# EAGLE design improved-handheld-turbidimeter_DAC_LED (EAGLE 7.3.0)
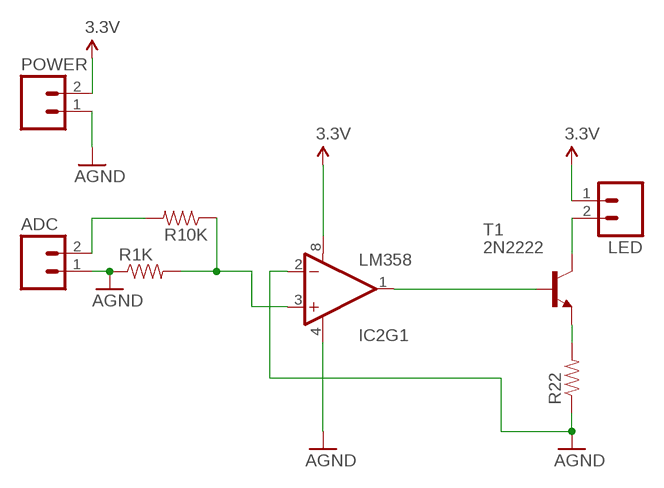
[diagram p0: schematic, sheet 1]

## Parts
ADC  M02PTH  [1X02]
IC2  LM358  [DIP08]
LED  M02PTH  [1X02]
POWER  M02PTH  [1X02]
R1K  RESISTOR0603-RES  [0603-RES]
R10K  RESISTOR0603-RES  [0603-RES]
R22  RESISTOR0603-RES  [0603-RES]
T1  2N2222  [TO92-EBC-OVAL]

## Nets
3.3V: IC2.8(V+) LED.1 POWER.2
AGND: ADC.1 IC2.2(-IN) IC2.4(V-) POWER.1 R1K.1 R22.1
N$1: IC2.1(OUT) T1.B
N$2: LED.2 T1.C
N$3: R22.2 T1.E
N$5: ADC.2 R10K.2
N$6: IC2.3(+IN) R1K.2 R10K.1
Unconnected: IC2.5(+IN) IC2.6(-IN) IC2.7(OUT)

## Library data of the parts
ADC LED POWER = SparkFun-Connectors:M02: Standard 2-pin 0.1" header. Use with - straight break away headers ( PRT-00116) - right angle break away headers (PRT-00553) - swiss pins (PRT-00743) - machine pins (PRT-00117) - female headers (PRT-00115) Molex polarized connector foot print use with: PRT-08233 with associated crimp pins and housings. 2.54_SCREWTERM for use with PRT-10571. 3.5mm Screw Terminal footprints for PRT-08084 5mm Screw Terminal footprints for use with PRT-08432
IC2 = SparkFun-AnalogIC:LM358: Jellybean op-amp; PROD_ID: IC-09172
R1K R10K R22 = SparkFun-Passives:RESISTOR: Resistor Basic schematic elements and footprints for 0603, 1206, and PTH resistors.
T1 = adafruit:2N2222: NPN TRANSISTOR Big oval pads

## Board
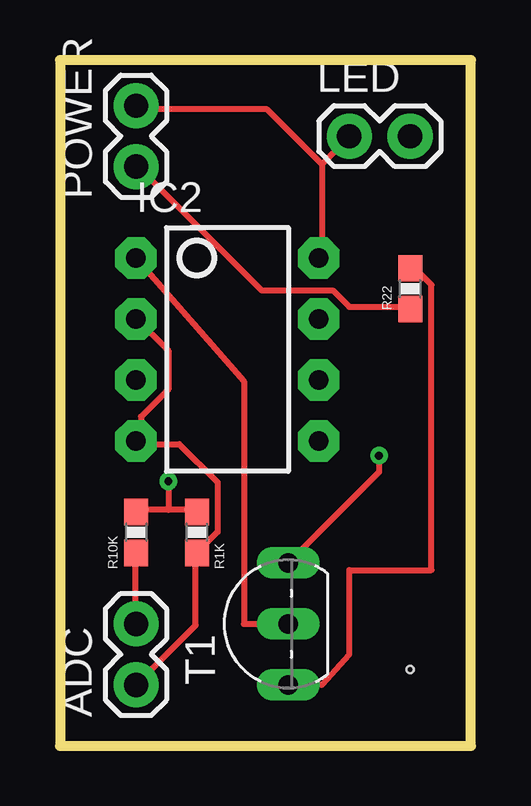
[diagram p1: board, top side]
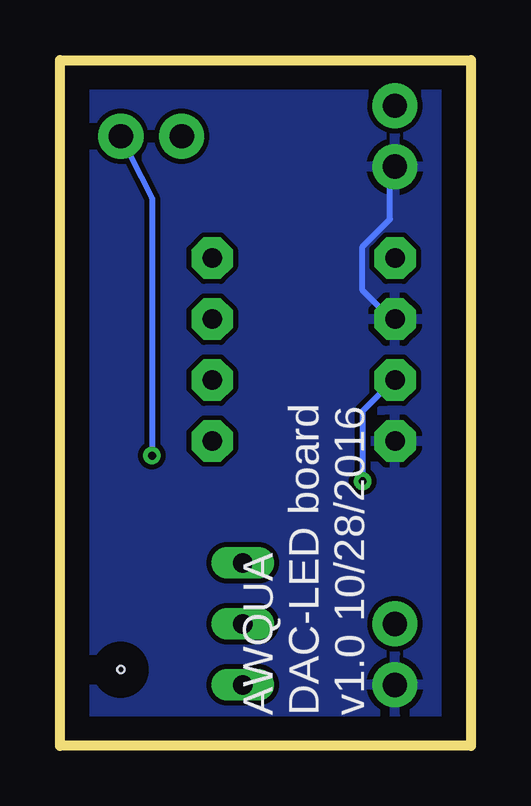
[diagram p2: board, bottom side, seen from below]

Size 17.15 x 28.57 mm. Coordinates in mm from the lower left corner, seen from the top.
Outline: 0,0 17.15,0 17.15,28.57 0,28.57 0,0
Copper layers (1*16): Top 0.035mm / dielectric 1.5mm / Bottom 0.035mm
Design rules "default": minimum track width 10mil, minimum drill 24mil, track to track 8mil, track to pad 8mil, pad to pad 8mil, via to via 8mil, smd to smd 8mil, copper to edge 40mil, drill to drill 8mil, minimum pad ring 10mil, minimum via ring 8mil, stop-mask expansion 4mil, vias tented up to drill 0mil, thermal gap 10mil
Holes 0.3 mm at 14.61,3.17

### Footprints (pad centres in the part's own frame; a part is rotated, then mirrored left to right if it is on the bottom)
1X02 = drill 1.016 pad 1.88: 1 0,0; 2 2.54,0
DIP08 = drill 0.813 pad 1.727 octagon: 1 -3.81,-3.81; 2 -1.27,-3.81; 3 1.27,-3.81; 4 3.81,-3.81; 5 3.81,3.81; 6 1.27,3.81; 7 -1.27,3.81; 8 -3.81,3.81
0603-RES = smd 1.1 x 1: 1 -0.85,0; 2 0.85,0
TO92-EBC-OVAL = drill 0.813 long: B 0,-1.27; C 2.54,-1.27; E -2.54,-1.27

### Placement (x,y rotation side)
ADC  3.17,2.54 90 top
IC2  6.98,16.51 270 top
LED  12.06,25.4 0 top
POWER  3.17,24.13 90 top
R1K  5.71,8.89 90 top
R10K  3.17,8.89 270 top
R22  14.61,19.05 90 top
T1  8.26,5.08 90 top

### Tracks (layer width: path | path; a pad name or v marks a point on that pad's centre or on a via)
3.3V
  Top 0.254: 10.92,24.23 10.92,20.34 IC2.8 | 10.92,24.23 12.06,25.38 LED.1 | 10.92,24.23 8.64,26.52 3.38,26.52 POWER.2
AGND
  Top 0.254: R22.1 14.58,18.29 12.06,18.29 11.38,18.97 8.41,18.97 3.38,24 POWER.1 | ADC.1 5.66,5.03 5.66,8 R1K.1 5.89,8.23 6.58,8.91 6.58,10.97 4.98,12.57 3.38,12.57 IC2.4 3.38,12.8 3.38,13.72 4.52,14.86 4.52,16.46 3.38,17.6 IC2.2
  Bottom 0.254: POWER.1 3.38,24 3.38,21.95 4.52,20.8 4.52,18.97 3.38,17.83 IC2.2
  pour Bottom: -1.27,30.48 19.05,30.48 19.05,-1.91 -1.27,-1.91
N$1
  Top 0.254: IC2.1 7.67,15.19 7.67,5.08 T1.B
N$2  (via drill 0.33)
  Top 0.254: v13.31,12.09 13.31,11.4 T1.C
  Bottom 0.254: v13.31,12.09 13.31,22.84 LED.2
N$3
  Top 0.254: R22.2 14.81,19.89 15.49,19.2 15.49,7.32 12.06,7.32 12.06,3.81 10.92,2.54 T1.E
N$5
  Top 0.254: R10K.2 3.15,8 3.15,5.26 ADC.2
N$6  (via drill 0.33)
  Top 0.254: 4.52,9.83 5.66,9.83 R1K.2 | 4.52,9.83 3.38,9.83 R10K.1 | v4.52,11.02 4.52,9.83
  Bottom 0.254: v4.52,11.02 4.52,13.95 3.38,15.09 IC2.3

### Text on the board
bNames: AWQUA / DAC-LED board / v1.0 10/28/2016